# Altium schematic sheet FPGA开发板.SchDoc
size A3; SheetNumber: 1; SheetTotal: 1
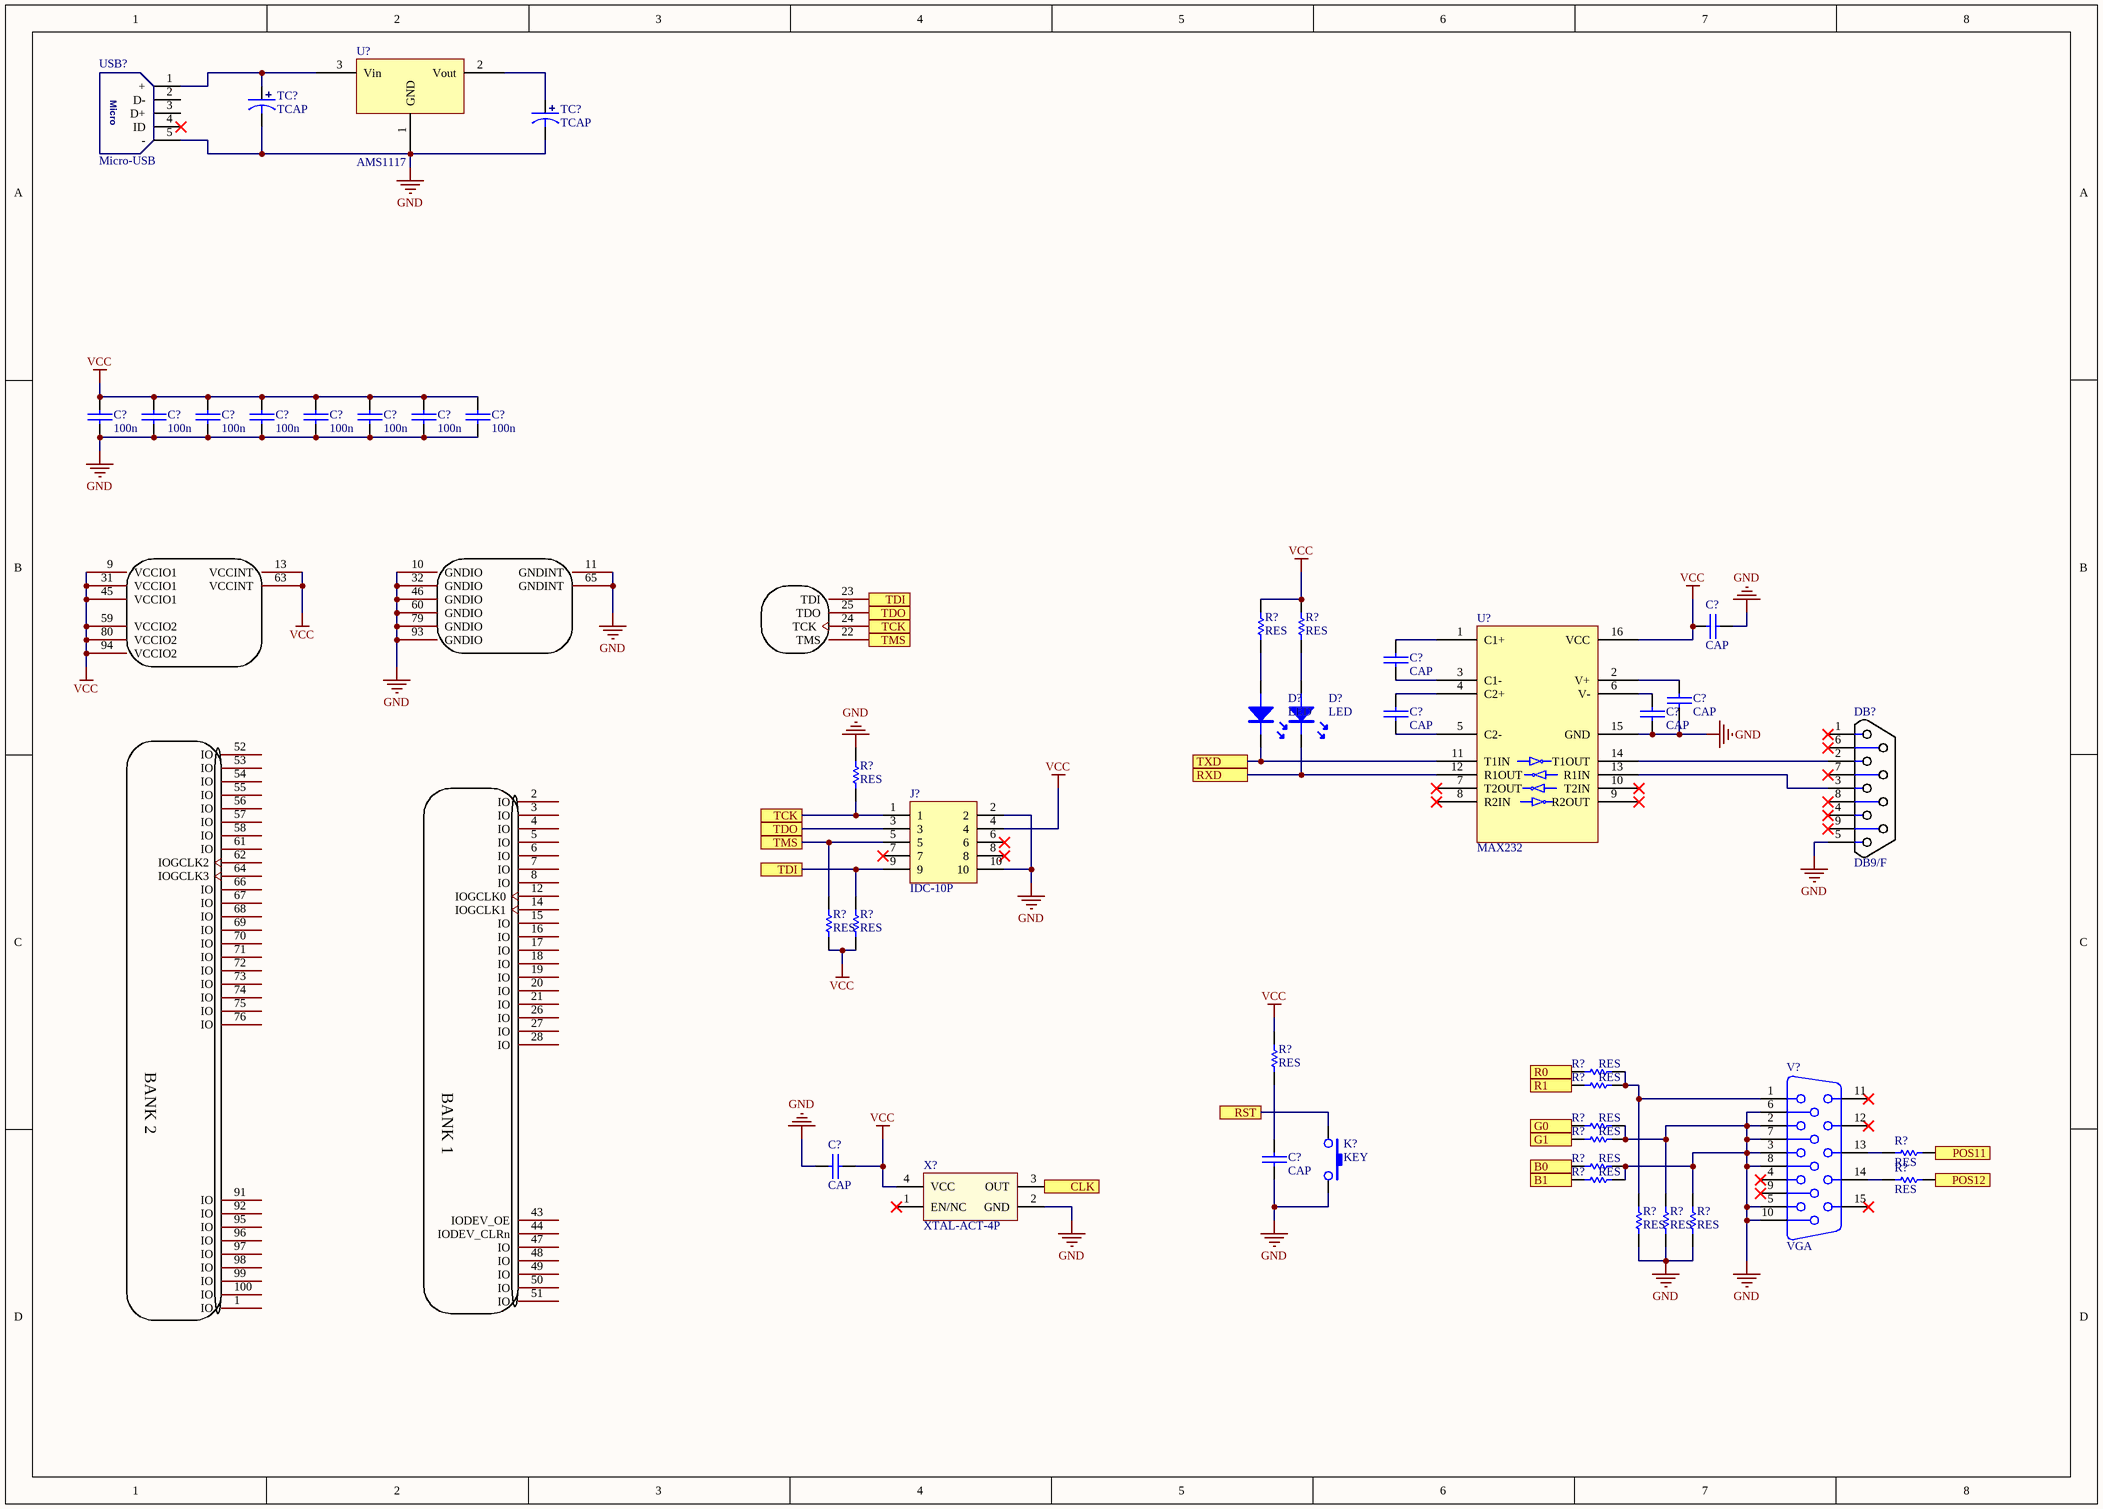
[diagram p0: FPGA开发板.SchDoc]

## Parts
(Parts that share a designator on the sheet are numbered #1, #2 ... from top to bottom, then left to right.)
?#1  EPM240T100C5N  (value not drawn)  (part D of 5)
?#2  EPM240T100C5N  (value not drawn)  (part A of 5)
?#3  EPM240T100C5N  (value not drawn)  (part C of 5)
?#4  EPM240T100C5N  (value not drawn)  (part B of 5)
?#5  EPM240T100C5N  (value not drawn)  (part E of 5)
C?#1  100n  [0201C]
C?#2  100n  [0201C]
C?#3  100n  [0201C]
C?#4  100n  [0201C]
C?#5  100n  [0201C]
C?#6  100n  [0201C]
C?#7  100n  [0201C]
C?#8  100n  [0201C]
C?#9  CAP  [0201C]
C?#10  CAP  [0201C]
C?#11  CAP  [0201C]
C?#12  CAP  [0201C]
C?#13  CAP  [0201C]
C?#14  CAP  [0201C]
C?#15  CAP  [0201C]
D?#1  LED  [LED5-BLUE]
D?#2  LED  [LED5-BLUE]
DB?  DB9/F  [DB9/F/180]
J?  IDC-10P  [IDC2.54-10P]
K?  KEY  [DIP-3X6X4.3]
R?#1  RES  [0201R]
R?#2  RES  [0201R]
R?#3  RES  [0201R]
R?#4  RES  [0201R]
R?#5  RES  [0201R]
R?#6  RES  [0201R]
R?#7  RES  [0201R]
R?#8  RES  [0201R]
R?#9  RES  [0201R]
R?#10  RES  [0201R]
R?#11  RES  [0201R]
R?#12  RES  [0201R]
R?#13  RES  [0201R]
R?#14  RES  [0201R]
R?#15  RES  [0201R]
R?#16  RES  [0201R]
R?#17  RES  [0201R]
TC?#1  TCAP  [TAJ-A/3216]
TC?#2  TCAP  [TAJ-A/3216]
U?#1  AMS1117  [SOT223]
U?#2  MAX232  [DIP16_SS]
USB?  Micro-USB  [USB-MICRO_A]
V?  VGA  [VGA15/F/90]
X?  XTAL-ACT-4P  [OSC 3225-4P]

## Ports
B0, B1, CLK, G0, G1, POS11, POS12, R0, R1, RST, RXD, TCK, TDI, TDO, TMS, TXD

## Nets
GND: ?#1.10(GNDIO) ?#1.11(GNDINT) ?#1.32(GNDIO) ?#1.46(GNDIO) ?#1.60(GNDIO) ?#1.65(GNDINT) ?#1.79(GNDIO) ?#1.93(GNDIO) C?#1.1 C?#2.1 C?#3.1 C?#4.1 C?#5.1 C?#6.1 C?#7.1 C?#8.1 C?#9.2 C?#11.1 C?#13.1 C?#14.1 C?#15.1 DB?.5 J?.2 J?.10 K?.3 R?#3.2 R?#9.2 R?#10.2 R?#12.2 R?#13.2 R?#15.1 R?#16.1 R?#16.2 R?#17.1 R?#17.2 TC?#1.2 TC?#2.2 U?#1.1(GND) U?#2.15(GND) USB?.5(-) V?.2 V?.3 V?.5 V?.6 V?.7 V?.8 V?.10 X?.2(GND)
VCC: ?#2.9(VCCIO1) ?#2.13(VCCINT) ?#2.31(VCCIO1) ?#2.45(VCCIO1) ?#2.59(VCCIO2) ?#2.63(VCCINT) ?#2.80(VCCIO2) ?#2.94(VCCIO2) C?#1.2 C?#2.2 C?#3.2 C?#4.2 C?#5.2 C?#6.2 C?#7.2 C?#8.2 C?#9.1 C?#14.2 J?.4 R?#1.2 R?#2.2 R?#4.1 R?#5.1 R?#7.2 U?#2.16(VCC) X?.4(VCC)
B0: R?#12.1 ; port B0
B1: R?#13.1 ; port B1
CLK: X?.3(OUT) ; port CLK
G0: R?#9.1 ; port G0
G1: R?#10.1 ; port G1
POS11: R?#11.2 ; port POS11
POS12: R?#14.2 ; port POS12
R0: R?#6.1 ; port R0
R1: R?#8.1 ; port R1
RST: K?.1 ; port RST
RXD: D?#2.K U?#2.12(R1OUT) ; port RXD
TCK: ?#3.24(TCK) J?.1 R?#3.1 ; port TCK
TDI: ?#3.23(TDI) J?.9 R?#5.2 ; port TDI
TDO: ?#3.25(TDO) J?.3 ; port TDO
TMS: ?#3.22(TMS) J?.5 R?#4.2 ; port TMS
TXD: D?#1.K U?#2.11(T1IN) ; port TXD
NetC?#10_1: C?#10.1 U?#2.3(C1-)
NetC?#10_2: C?#10.2 U?#2.1(C1+)
NetC?#11_2: C?#11.2 U?#2.2(V+)
NetC?#12_1: C?#12.1 U?#2.5(C2-)
NetC?#12_2: C?#12.2 U?#2.4(C2+)
NetC?#13_2: C?#13.2 U?#2.6(V-)
NetC?#15_2: C?#15.2 R?#7.1
NetD?#1_A: D?#1.A R?#1.1
NetD?#2_A: D?#2.A R?#2.1
NetDB?_2: DB?.2 U?#2.14(T1OUT)
NetDB?_3: DB?.3 U?#2.13(R1IN)
NetR?#6_2: R?#6.2 R?#8.2 R?#15.2 V?.1
NetR?#11_1: R?#11.1 V?.13
NetR?#14_1: R?#14.1 V?.14
NetTC?#1_1: TC?#1.1 U?#1.3(Vin) USB?.1(+)
NetTC?#2_1: TC?#2.1 U?#1.2(Vout)

Not connected (* = marked no-connect by the designer): ?#4 1(IO) 52(IO) 53(IO) 54(IO) 55(IO) 56(IO) 57(IO) 58(IO) 61(IO) 62(IOGCLK2) 64(IOGCLK3) 66(IO) 67(IO) 68(IO) 69(IO) 70(IO) 71(IO) 72(IO) 73(IO) 74(IO) 75(IO) 76(IO) 77(IO) 78(IO) 81(IO) 82(IO) 83(IO) 84(IO) 85(IO) 86(IO) 87(IO) 88(IO) 89(IO) 90(IO) 91(IO) 92(IO) 95(IO) 96(IO) 97(IO) 98(IO) 99(IO) 100(IO); ?#5 2(IO) 3(IO) 4(IO) 5(IO) 6(IO) 7(IO) 8(IO) 12(IOGCLK0) 14(IOGCLK1) 15(IO) 16(IO) 17(IO) 18(IO) 19(IO) 20(IO) 21(IO) 26(IO) 27(IO) 28(IO) 29(IO) 30(IO) 33(IO) 34(IO) 35(IO) 36(IO) 37(IO) 38(IO) 39(IO) 40(IO) 41(IO) 42(IO) 43(IODEV_OE) 44(IODEV_CLRn) 47(IO) 48(IO) 49(IO) 50(IO) 51(IO); DB? 1* 4* 6* 7* 8* 9*; J? 6* 7* 8*; U?#2 7(T2OUT)* 8(R2IN)* 9(R2OUT)* 10(T2IN)*; USB? 2(D-) 3(D+) 4(ID)*; V? 4* 9* 11* 12* 15*; X? 1(EN/NC)*

## Notes on the sheet
- (in symbol EPM240T100C5N, part B) BANK 2
- (in symbol EPM240T100C5N, part E) BANK 1
- (in symbol Micro-USB) Micro

## Library data of the parts
?#1-?#5 = EPM240T100C5N: Designer: U?; Symbol: EPM240T100C5N; Device: EPM240T100C5N
C?#1-C?#15 = CAP: 无极性电容
TC?#1 TC?#2 = TCAP: 钽电容
U?#1 = AMS1117: 三端稳压芯片
X? = XTAL-ACT-4P: 4脚有源晶振